# EAGLE design Headphone-Amplifier-ClassAB-Stereo (EAGLE 7.6.0)
4x4 - Three Transistor Headphone Amplifier - Class AB http://www.electronics-diy.com/4x4.php
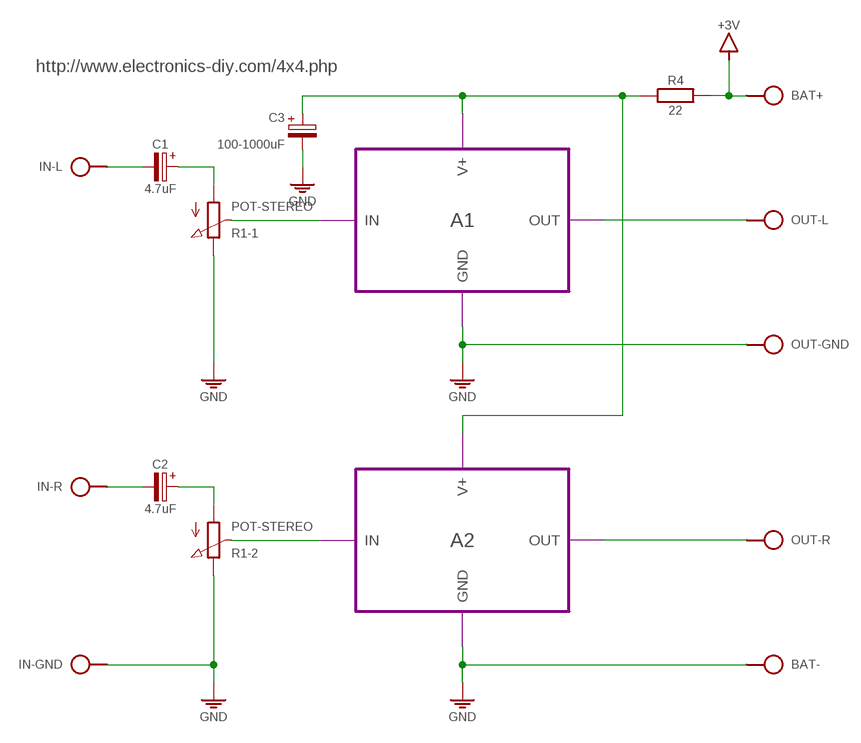
[diagram p0: schematic, sheet 1]

## Parts
BAT  SPAD+-+-  [SPAD+-]
C1  4.7uF  CPOLE2,5-4  [E2,5-4]
C2  4.7uF  CPOLE2,5-4  [E2,5-4]
C3  100-1000uF  CPOLE5-6  [E5-6]
IN  SAUDIO  [SPAD-3]
OUT  SAUDIO  [SPAD-3]
R1  POT-STEREO  [POT-STEREO-2X3]
R4  22  R-H0204/10  [0204/10]

## Module instances
A1 = HDPH-AMP
A2 = HDPH-AMP

## Nets
+3V: BAT.2 R4.2
GND: BAT.1 C3.- IN.2 OUT.2 R1.1-E(-1:E) R1.2-E(-2:E) ; port A1.GND A2.GND
N$1: C3.+ R4.1 ; port A1.V+ A2.V+
N$2: OUT.1 ; port A1.OUT
N$3: C2.- IN.3
N$4: C2.+ R1.2-A(-2:A)
N$5: C1.+ R1.1-A(-1:A)
N$6: R1.1-S(-1:S) ; port A1.IN
N$7: R1.2-S(-2:S) ; port A2.IN
N$8: OUT.3 ; port A2.OUT
N$10: C1.- IN.1

## Notes on the sheet
- http://www.electronics-diy.com/4x4.php

## Library data of the parts
BAT = pad:SPAD+-
C1-C3 = c:CPOL: POLARIZED CAPACITOR, European symbol
IN OUT = pad:SAUDIO
R1 = r:POT-STEREO
R4 = r:R-H

## Module HDPH-AMP
Ports: GND(pwr) V+(pwr) IN(in) OUT(out)
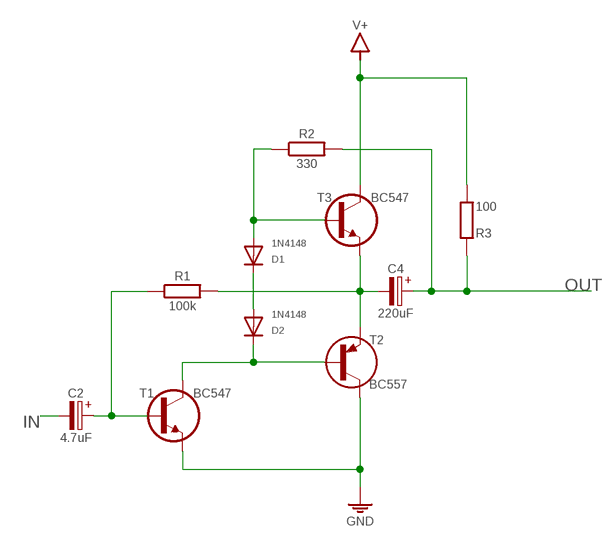
[diagram p1: schematic, module HDPH-AMP, sheet 1]

### Parts
C2  4.7uF  CPOLE2,5-4  [E2,5-4]
C4  220uF  CPOLE5-5/V  [E5-5/V]
D1  1N4148  1N414834-5V  [DO34-5V]
D2  1N4148  1N414834-5V  [DO34-5V]
R1  100k  R-H0202/5-V  [0202/5-V]
R2  330  R-H0202/5-V  [0202/5-V]
R3  100  R0202/5-V  [0202/5-V]
T1  BC547  BC547CBE  [TO92-CBE]
T2  BC557  BC557CBE  [TO92-CBE]
T3  BC547  BC547CBE  [TO92-CBE]

### Nets
GND: T1.E T2.C
IN: C2.-
N$1: D1.A R2.1 T3.B
N$2: D2.C T1.C T2.B
N$3: D1.C D2.A
N$4: C4.- R1.2 T2.E T3.E
N$7: C2.+ R1.1 T1.B
OUT: C4.+ R2.2 R3.2
V+: R3.1 T3.C

### Library data of the parts
C2 C4 = c:CPOL: POLARIZED CAPACITOR, European symbol
D1 D2 = d:1N4148
R1 R2 = r:R-H
R3 = r:R: RESISTOR, European symbol
T1 T3 = t:BC547
T2 = t:BC557

## Board
4x4 - Three Transistor Headphone Amplifier - Class AB http://www.electronics-diy.com/4x4.php
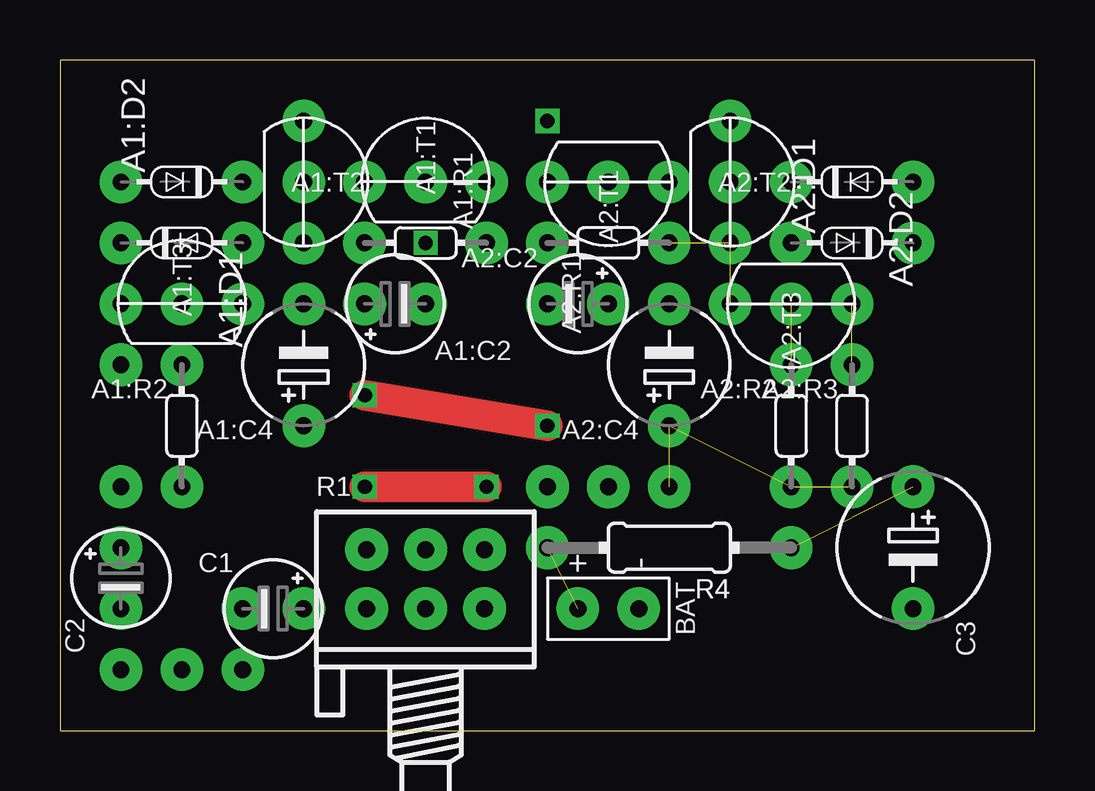
[diagram p2: board, top side]
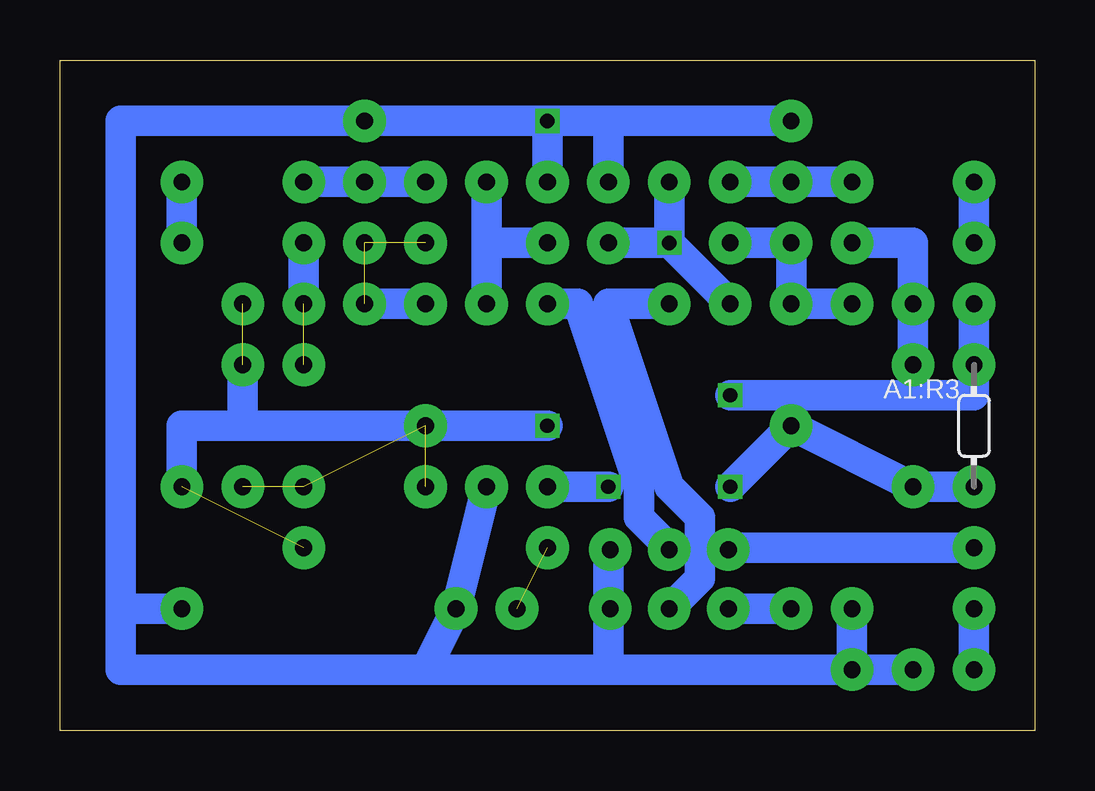
[diagram p3: board, bottom side, seen from below]

Size 40.64 x 27.94 mm. Coordinates in mm from the lower left corner, seen from the top.
Outline: 0,0 40.64,0 40.64,27.94 0,27.94 0,0
Copper layers (1*16): Top 0.035mm / dielectric 1.5mm / Bottom 0.035mm
Design rules "default": minimum track width 10mil, minimum drill 24mil, track to track 8mil, track to pad 8mil, pad to pad 8mil, via to via 8mil, smd to smd 8mil, copper to edge 40mil, drill to drill 8mil, minimum pad ring 10mil, minimum via ring 8mil, stop-mask expansion 4mil, vias tented up to drill 0mil, thermal gap 10mil

### Footprints (pad centres in the part's own frame; a part is rotated, then mirrored left to right if it is on the bottom)
E2,5-4 = drill 0.7 pad 1.778: + 0,1.27; - 0,-1.27
E5-5/V = drill 0.7 pad 1.778: + 0,2.54; - 0,-2.54
DO34-5V = drill 0.7 pad 1.778: A 0,2.54; C 0,-2.54
0202/5-V = drill 0.7 pad 1.778: 1 0,2.54; 2 0,-2.54
TO92-CBE = drill 0.7 pad 1.778: B 0,0; C 0,2.54; E 0,-2.54
SPAD+- = drill 0.7 pad 1.778: 1 0,-1.27; 2 0,1.27
E5-6 = drill 0.7 pad 1.778: + -2.54,0; - 2.54,0
SPAD-3 = drill 0.7 pad 1.778: 1 -2.54,0; 2 0,0; 3 2.54,0
POT-STEREO-2X3 = drill 0.7 pad 1.778: 1-A -2.46,-2.54; 1-E 2.46,-2.54; 1-S 0,-2.54; 2-A -2.46,-0.08; 2-E 2.46,-0.08; 2-S 0,-0.08
0204/10 = drill 0.7 pad 1.778: 1 -5.08,0; 2 5.08,0

### Placement (x,y rotation side)
A1:C2  4.7μF  [E2,5-4]  13.97,17.78 90 top
A1:C4  220μF  [E5-5/V]  10.16,15.24 180 top
A1:D1  1N4148  [DO34-5V]  5.08,20.32 270 top
A1:D2  1N4148  [DO34-5V]  5.08,22.86 90 top
A1:R1  100kΩ  [0202/5-V]  15.24,20.32 270 top
A1:R2  330  [0202/5-V]  5.08,12.7 0 top
A1:R3  100  [0202/5-V]  2.54,12.7 0 bottom
A1:T1  BC547  [TO92-CBE]  15.24,22.86 90 top
A1:T2  BC557  [TO92-CBE]  10.16,22.86 0 top
A1:T3  BC547  [TO92-CBE]  5.08,17.78 90 top
A2:C2  4.7μF  [E2,5-4]  21.59,17.78 270 top
A2:C4  220μF  [E5-5/V]  25.4,15.24 180 top
A2:D1  1N4148  [DO34-5V]  33.02,20.32 90 top
A2:D2  1N4148  [DO34-5V]  33.02,22.86 270 top
A2:R1  100kΩ  [0202/5-V]  22.86,20.32 90 top
A2:R2  330  [0202/5-V]  30.48,12.7 0 top
A2:R3  100  [0202/5-V]  33.02,12.7 0 top
A2:T1  BC547  [TO92-CBE]  22.86,22.86 270 top
A2:T2  BC557  [TO92-CBE]  27.94,22.86 0 top
A2:T3  BC547  [TO92-CBE]  30.48,17.78 270 top
BAT  22.86,5.08 90 top
C1  4.7μF  [E2,5-4]  8.89,5.08 270 top
C2  4.7μF  [E2,5-4]  2.54,6.35 0 top
C3  100-1000μF  [E5-6]  35.56,7.62 270 top
IN  5.08,2.54 180 top
OUT  22.86,10.16 0 top
R1  15.24,7.62 0 top
R4  22Ω  [0204/10]  25.4,7.62 180 top

### Tracks (layer width: path | path; a pad name or v marks a point on that pad's centre or on a via)
+3V  (1 unrouted)
A1:N$1
  Bottom 1.27: A1:R2.1 A1:T3.B 5.08,20.32 A1:D1.A
A1:N$2
  Bottom 1.27: A1:T1.C A1:T2.B A1:D2.C
A1:N$3
  Bottom 1.27: A1:D1.C A1:D2.A
A1:N$4
  Bottom 1.27: A1:R1.2 A1:T2.E A1:C4.- A1:T3.E
A1:N$7  (via drill 0.6)
  Bottom 1.27: A1:T1.B v15.24,20.32 | A1:R1.1 v15.24,20.32 | v15.24,20.32 A1:C2.+
A2:N$1  (1 unrouted)
  Bottom 1.27: A2:D1.A A2:T3.B
A2:N$2
  Bottom 1.27: A2:D2.C A2:T1.C A2:T2.B
A2:N$3
  Bottom 1.27: A2:D2.A A2:D1.C
A2:N$4  (2 unrouted)
  Bottom 1.27: A2:T3.E A2:C4.-
A2:N$7
  Bottom 1.27: 22.86,20.32 A2:T1.B | 22.86,20.32 A2:R1.1 22.86,20.32 | 22.86,20.32 22.86,19.05 A2:C2.+
GND  (via drill 0.6)
  Bottom 1.27: 38.1,5.08 38.1,25.4 A2:T2.C v20.32,25.4 | A2:T1.E v20.32,25.4 | v20.32,25.4 A1:T2.C 17.78,25.4 A1:T1.E | IN.2 17.78,2.54 | 17.78,7.62 17.78,5.08 17.78,2.54 | 17.78,2.54 25.4,2.54 | 25.4,2.54 BAT.1 OUT.2 | 25.4,2.54 38.1,2.54 38.1,5.08 | 38.1,5.08 C3.-
N$1  (via drill 0.6)  (2 unrouted)
  Top 1.27: v12.7,13.97 v20.32,12.7
  Bottom 1.27: A1:T3.C A1:R3.1 2.54,13.97 v12.7,13.97 | v20.32,12.7 33.02,12.7 | 33.02,12.7 A2:R3.1 | C3.+ 35.56,12.7 33.02,12.7
N$2  (via drill 0.6)
  Top 1.27: v12.7,10.16 v17.78,10.16
  Bottom 1.27: A1:R3.2 A1:R2.2 A1:C4.+ v12.7,10.16 | v17.78,10.16 OUT.1
  other vias: 10.16,12.7
N$3
  Bottom 1.27: C2.- IN.3
N$4
  Bottom 1.27: C2.+ 12.7,7.62 | 12.7,7.62
N$5
  Bottom 1.27: 12.7,5.08 C1.+
N$6
  Bottom 1.27: R1.1-S 13.97,6.35 13.97,8.89 15.24,10.16 17.78,17.78 A1:C2.-
N$7
  Bottom 1.27: A2:C2.- 19.05,17.78 16.51,10.16 16.51,8.89 15.24,7.62
N$8  (3 unrouted)
N$10
  Bottom 1.27: C1.- IN.1